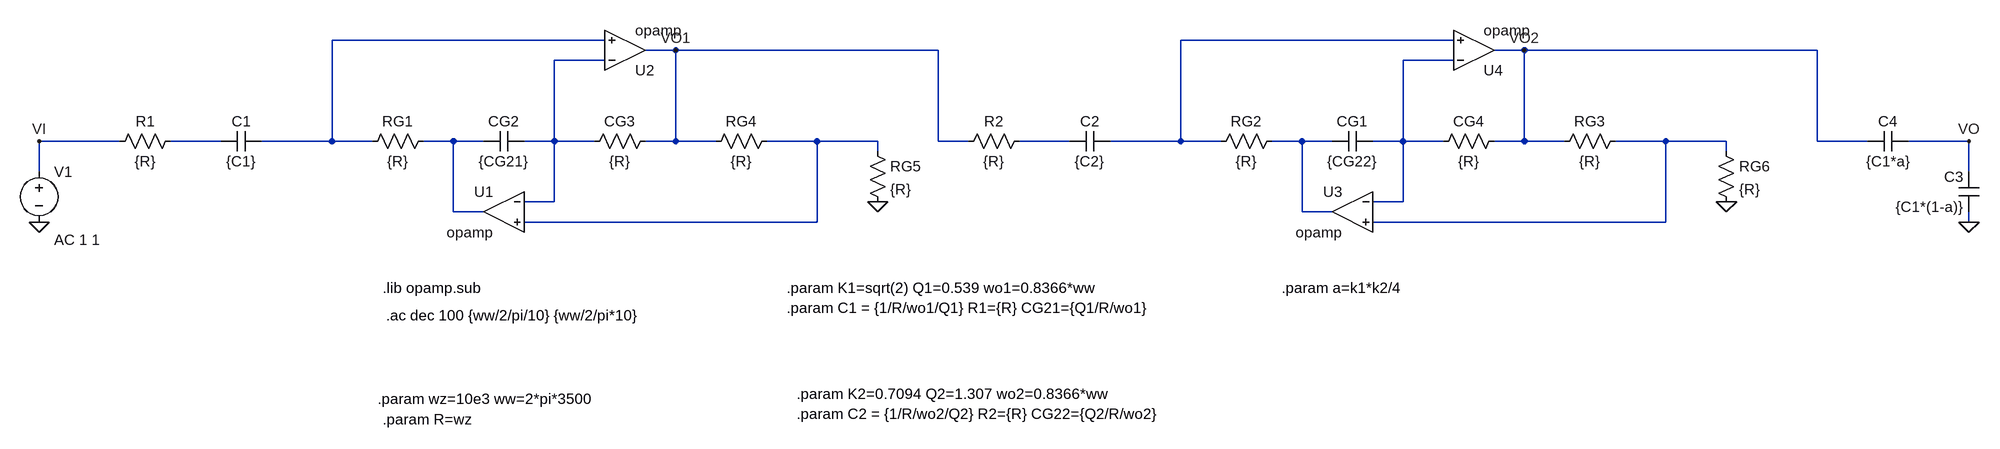
[diagram p0: schematic Bobia_Activa.asc]
Bobia_Activa.asc, the LTspice schematic file:
Version 4
SHEET 1 2816 680
WIRE 624 16 192 16
WIRE 1968 16 1536 16
WIRE 736 32 688 32
WIRE 1152 32 736 32
WIRE 2080 32 2032 32
WIRE 2544 32 2080 32
WIRE 624 48 544 48
WIRE 1968 48 1888 48
WIRE -144 176 -272 176
WIRE 16 176 -64 176
WIRE 192 176 192 16
WIRE 192 176 80 176
WIRE 256 176 192 176
WIRE 384 176 336 176
WIRE 432 176 384 176
WIRE 544 176 544 48
WIRE 544 176 496 176
WIRE 608 176 544 176
WIRE 736 176 736 32
WIRE 736 176 688 176
WIRE 800 176 736 176
WIRE 960 176 880 176
WIRE 1056 176 960 176
WIRE 1152 176 1152 32
WIRE 1200 176 1152 176
WIRE 1360 176 1280 176
WIRE 1536 176 1536 16
WIRE 1536 176 1424 176
WIRE 1600 176 1536 176
WIRE 1728 176 1680 176
WIRE 1776 176 1728 176
WIRE 1888 176 1888 48
WIRE 1888 176 1840 176
WIRE 1952 176 1888 176
WIRE 2080 176 2080 32
WIRE 2080 176 2032 176
WIRE 2144 176 2080 176
WIRE 2304 176 2224 176
WIRE 2400 176 2304 176
WIRE 2544 176 2544 32
WIRE 2624 176 2544 176
WIRE 2784 176 2688 176
WIRE 1056 192 1056 176
WIRE 2400 192 2400 176
WIRE -272 224 -272 176
WIRE 2784 224 2784 176
WIRE 544 272 544 176
WIRE 544 272 496 272
WIRE 1888 272 1888 176
WIRE 1888 272 1840 272
WIRE 384 288 384 176
WIRE 432 288 384 288
WIRE 1728 288 1728 176
WIRE 1776 288 1728 288
WIRE 960 304 960 176
WIRE 960 304 496 304
WIRE 2304 304 2304 176
WIRE 2304 304 1840 304
WIRE 2784 304 2784 288
FLAG 1056 272 0
FLAG -272 304 0
FLAG 2400 272 0
FLAG 2784 304 0
FLAG 2784 176 VO
FLAG 2080 32 VO2
FLAG 736 32 VO1
FLAG -272 176 VI
SYMBOL res -48 160 R90
WINDOW 0 0 56 VBottom 2
WINDOW 3 32 56 VTop 2
SYMATTR InstName R1
SYMATTR Value {R}
SYMBOL cap 80 160 R90
WINDOW 0 0 32 VBottom 2
WINDOW 3 32 32 VTop 2
SYMATTR InstName C1
SYMATTR Value {C1}
SYMBOL res 352 160 R90
WINDOW 0 0 56 VBottom 2
WINDOW 3 32 56 VTop 2
SYMATTR InstName RG1
SYMATTR Value {R}
SYMBOL cap 496 160 R90
WINDOW 0 0 32 VBottom 2
WINDOW 3 32 32 VTop 2
SYMATTR InstName CG2
SYMATTR Value {CG21}
SYMBOL res 704 160 R90
WINDOW 0 0 56 VBottom 2
WINDOW 3 32 56 VTop 2
SYMATTR InstName CG3
SYMATTR Value {R}
SYMBOL res 896 160 R90
WINDOW 0 0 56 VBottom 2
WINDOW 3 32 56 VTop 2
SYMATTR InstName RG4
SYMATTR Value {R}
SYMBOL OpAmps\\opamp 464 224 M0
SYMATTR InstName U1
SYMBOL OpAmps\\opamp 656 96 M180
SYMATTR InstName U2
SYMBOL res 1040 176 R0
SYMATTR InstName RG5
SYMATTR Value {R}
SYMBOL voltage -272 208 R0
WINDOW 123 24 124 Left 2
WINDOW 39 0 0 Left 0
SYMATTR InstName V1
SYMATTR Value ""
SYMATTR Value2 AC 1 1
SYMBOL res 1296 160 R90
WINDOW 0 0 56 VBottom 2
WINDOW 3 32 56 VTop 2
SYMATTR InstName R2
SYMATTR Value {R}
SYMBOL cap 1424 160 R90
WINDOW 0 0 32 VBottom 2
WINDOW 3 32 32 VTop 2
SYMATTR InstName C2
SYMATTR Value {C2}
SYMBOL res 1696 160 R90
WINDOW 0 0 56 VBottom 2
WINDOW 3 32 56 VTop 2
SYMATTR InstName RG2
SYMATTR Value {R}
SYMBOL cap 1840 160 R90
WINDOW 0 0 32 VBottom 2
WINDOW 3 32 32 VTop 2
SYMATTR InstName CG1
SYMATTR Value {CG22}
SYMBOL res 2048 160 R90
WINDOW 0 0 56 VBottom 2
WINDOW 3 32 56 VTop 2
SYMATTR InstName CG4
SYMATTR Value {R}
SYMBOL res 2240 160 R90
WINDOW 0 0 56 VBottom 2
WINDOW 3 32 56 VTop 2
SYMATTR InstName RG3
SYMATTR Value {R}
SYMBOL OpAmps\\opamp 1808 224 M0
SYMATTR InstName U3
SYMBOL OpAmps\\opamp 2000 96 M180
SYMATTR InstName U4
SYMBOL res 2384 176 R0
SYMATTR InstName RG6
SYMATTR Value {R}
SYMBOL cap 2688 160 R90
WINDOW 0 0 32 VBottom 2
WINDOW 3 32 32 VTop 2
SYMATTR InstName C4
SYMATTR Value {C1*a}
SYMBOL cap 2800 288 R180
WINDOW 0 24 56 Left 2
WINDOW 3 24 8 Left 2
SYMATTR InstName C3
SYMATTR Value {C1*(1-a)}
TEXT 272 408 Left 2 !.lib opamp.sub
TEXT 264 584 Left 2 !.param wz=10e3 ww=2*pi*3500
TEXT 278 452 Left 2 !.ac dec 100 {ww/2/pi/10} {ww/2/pi*10}
TEXT 272 616 Left 2 !.param R=wz
TEXT 912 408 Left 2 !.param K1=sqrt(2) Q1=0.539 wo1=0.8366*ww
TEXT 912 440 Left 2 !.param C1 = {1/R/wo1/Q1} R1={R} CG21={Q1/R/wo1}
TEXT 928 576 Left 2 !.param K2=0.7094 Q2=1.307 wo2=0.8366*ww
TEXT 928 608 Left 2 !.param C2 = {1/R/wo2/Q2} R2={R} CG22={Q2/R/wo2}
TEXT 1696 408 Left 2 !.param a=k1*k2/4

The netlist it stands for:
* Bobia_Activa.asc
R1 N005 VI {R}
C1 N001 N005 {C1}
RG1 N006 N001 {R}
CG2 N003 N006 {CG21}
R§CG3 VO1 N003 {R}
RG4 N007 VO1 {R}
XU1 N003 N007 N006 opamp Aol=100K GBW=10Meg  ; pins invin noninvin out
XU2 N003 N001 VO1 opamp Aol=100K GBW=10Meg  ; pins invin noninvin out
RG5 N007 0 {R}
V1 VI 0 AC 1 1
R2 N008 VO1 {R}
C2 N002 N008 {C2}
RG2 N009 N002 {R}
CG1 N004 N009 {CG22}
R§CG4 VO2 N004 {R}
RG3 N010 VO2 {R}
XU3 N004 N010 N009 opamp Aol=100K GBW=10Meg  ; pins invin noninvin out
XU4 N004 N002 VO2 opamp Aol=100K GBW=10Meg  ; pins invin noninvin out
RG6 N010 0 {R}
C4 VO VO2 {C1*a}
C3 0 VO {C1*(1-a)}
.lib opamp.sub
.param wz=10e3 ww=2*pi*3500
.ac dec 100 {ww/2/pi/10} {ww/2/pi*10}
.param R=wz
.param K1=sqrt(2) Q1=0.539 wo1=0.8366*ww
.param C1 = {1/R/wo1/Q1} R1={R} CG21={Q1/R/wo1}
.param K2=0.7094 Q2=1.307 wo2=0.8366*ww
.param C2 = {1/R/wo2/Q2} R2={R} CG22={Q2/R/wo2}
.param a=k1*k2/4
.backanno
.end

* Results of the author's LTspice run, read from the files saved beside the schematic
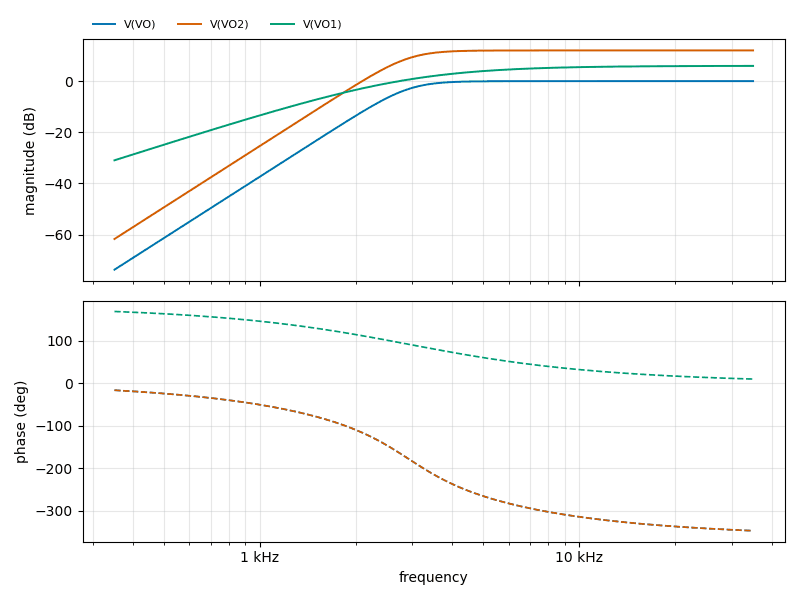
[diagram p1: AC Analysis of Bobia_Activa.asc, plotted from the saved traces]
* AC Analysis, 1 run:
*   V(VO): -73.77 dB at 350 Hz, 0.02 dB at 35 kHz, peak 0.02 dB at 34.2 kHz, 3 dB below the peak at 2.931 kHz
*   V(VO2): -61.76 dB at 350 Hz, 12.04 dB at 35 kHz, peak 12.04 dB at 34.2 kHz, 3 dB below the peak at 2.931 kHz
*   V(VO1): -30.96 dB at 350 Hz, 5.98 dB at 35 kHz, peak 5.98 dB at 35 kHz, 3 dB below the peak at 4.058 kHz